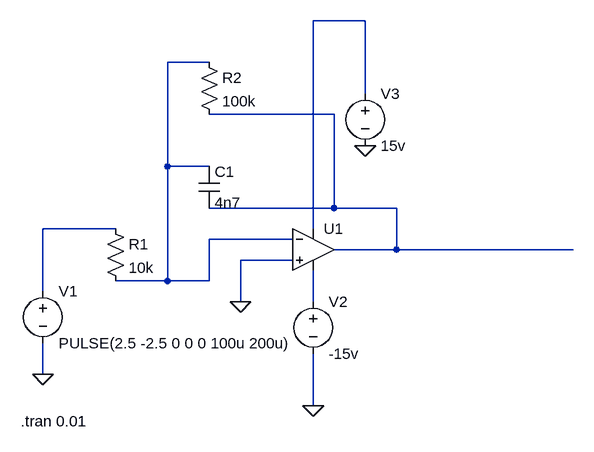
[diagram p0: schematic Draft2.asc]
Draft2.asc, the LTspice schematic file:
Version 4
SHEET 1 900 680
WIRE 576 -672 496 -672
WIRE 336 -608 272 -608
WIRE 576 -560 576 -672
WIRE 528 -528 336 -528
WIRE 272 -448 272 -608
WIRE 336 -448 272 -448
WIRE 528 -384 528 -528
WIRE 528 -384 336 -384
WIRE 624 -384 528 -384
WIRE 192 -352 80 -352
WIRE 496 -352 496 -672
WIRE 464 -336 336 -336
WIRE 624 -320 624 -384
WIRE 624 -320 528 -320
WIRE 896 -320 624 -320
WIRE 464 -304 384 -304
WIRE 272 -272 272 -448
WIRE 272 -272 192 -272
WIRE 336 -272 336 -336
WIRE 336 -272 272 -272
WIRE 80 -256 80 -352
WIRE 384 -240 384 -304
WIRE 496 -240 496 -288
WIRE 80 -128 80 -176
WIRE 496 -80 496 -160
FLAG 80 -128 0
FLAG 496 -80 0
FLAG 384 -240 0
FLAG 576 -480 0
SYMBOL voltage 80 -272 R0
WINDOW 123 0 0 Left 0
WINDOW 39 0 0 Left 0
SYMATTR InstName V1
SYMATTR Value PULSE(2.5 -2.5 0 0 0 100u 200u)
SYMBOL res 176 -368 R0
SYMATTR InstName R1
SYMATTR Value 10k
SYMBOL OpAmps\\UniversalOpamp2 496 -320 R0
SYMATTR InstName U1
SYMBOL voltage 496 -256 R0
WINDOW 123 0 0 Left 0
WINDOW 39 0 0 Left 0
SYMATTR InstName V2
SYMATTR Value -15v
SYMBOL cap 320 -448 R0
SYMATTR InstName C1
SYMATTR Value 4n7
SYMBOL res 320 -624 R0
SYMATTR InstName R2
SYMATTR Value 100k
SYMBOL voltage 576 -576 R0
SYMATTR InstName V3
SYMATTR Value 15v
TEXT 46 -56 Left 2 !.tran 0.01

The netlist it stands for:
* Draft2.asc
V1 N004 0 PULSE(2.5 -2.5 0 0 0 100u 200u)
R1 N004 N002 10k
XU1 0 N002 N001 N005 N003 level.2 Avol=1Meg GBW=10Meg Slew=10Meg ilimit=25m rail=0 Vos=0 phimargin=45 en=0 enk=0 in=0 ink=0 Rin=500Meg  ; pins IN+ IN- V+ V- OUT
V2 N005 0 -15v
C1 N002 N003 4n7
R2 N002 N003 100k
V3 N001 0 15v
.tran 0.01
.lib UniversalOpamps2.sub
.backanno
.end